# Altium schematic sheet Connectors.SchDoc
size Tabloid; SheetNumber: 2; SheetTotal: 11
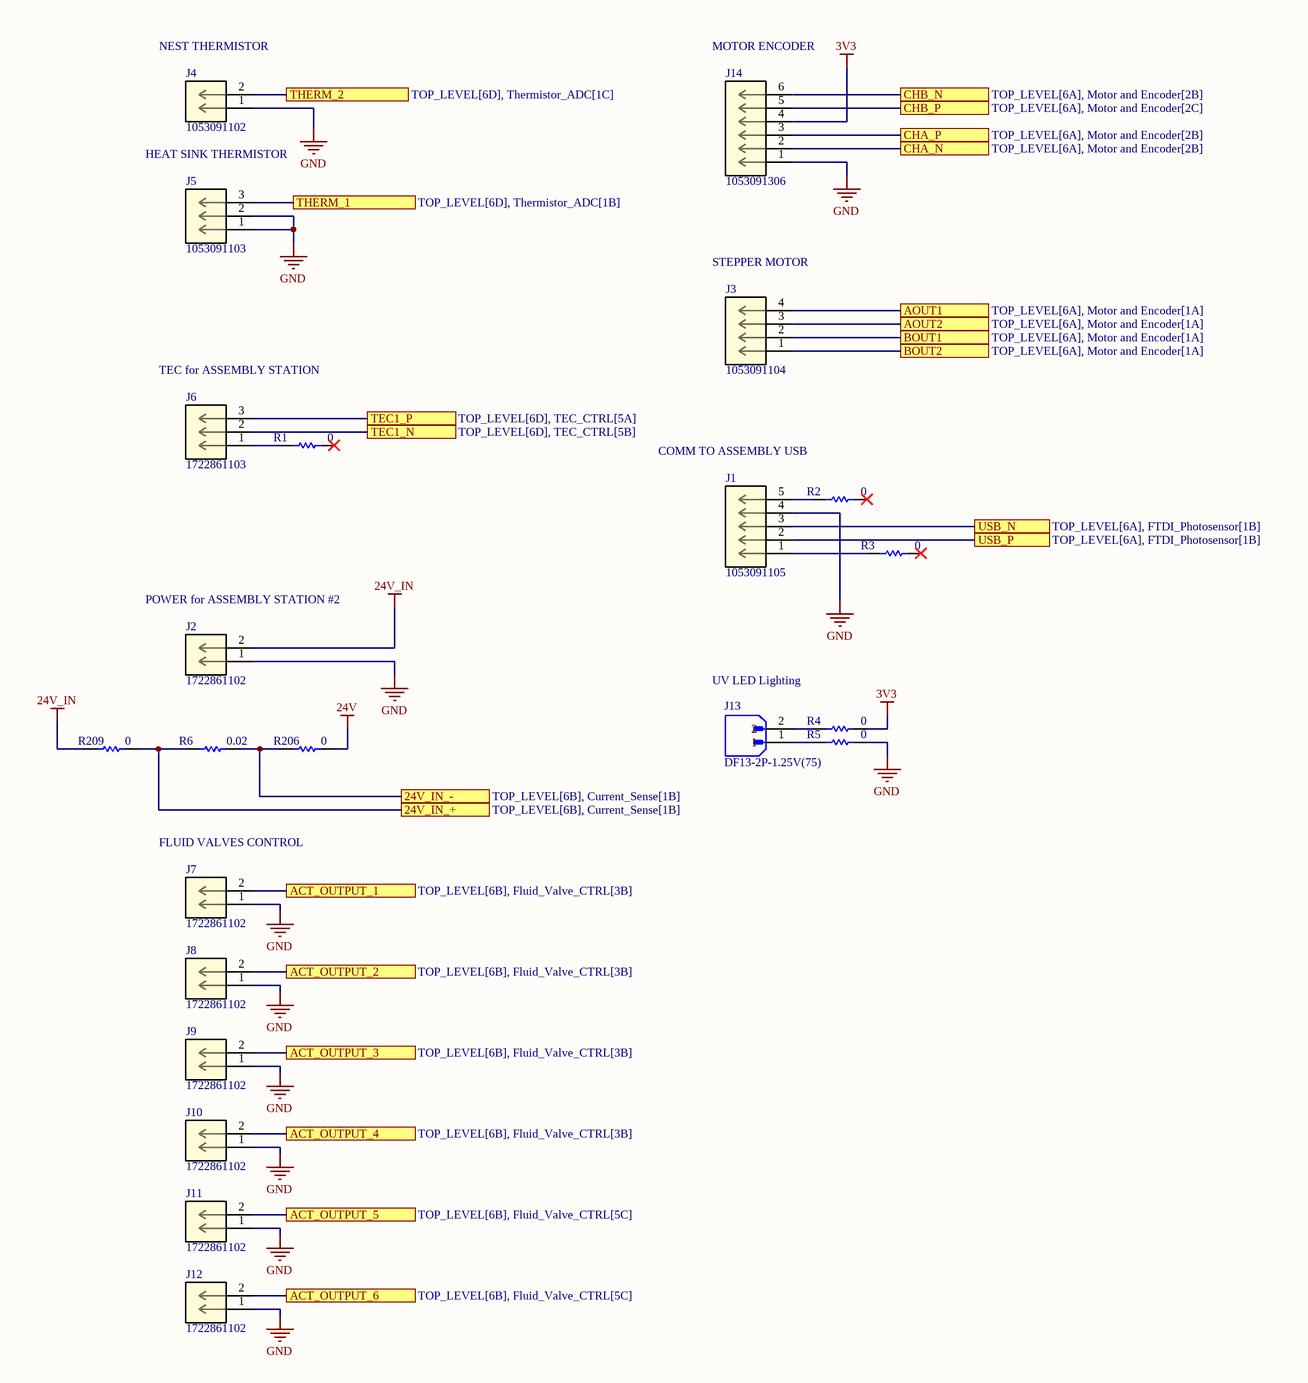
[diagram p0: Connectors.SchDoc]

## Parts
J1  1053091105  [1053091105]
J2  1722861102  [1722861102]
J3  1053091104  [1053091104]
J4  1053091102  [1053091102]
J5  1053091103  [1053091103]
J6  1722861103  [1722861103]
J7  1722861102  [1722861102]
J8  1722861102  [1722861102]
J9  1722861102  [1722861102]
J10  1722861102  [1722861102]
J11  1722861102  [1722861102]
J12  1722861102  [1722861102]
J13  DF13-2P-1.25V(75)  [DF13-2P-1.25V(75)]
J14  1053091306  [1053091306]
R1  value 0  [DEFAULT_RESISTOR_0805]  (hidden comment: RC0805JR-070RL)
R2  value 0  [DEFAULT_RESISTOR_0805]  (hidden comment: RC0805JR-070RL)
R3  value 0  [DEFAULT_RESISTOR_0805]  (hidden comment: RC0805JR-070RL)
R4  value 0  [DEFAULT_RESISTOR_0805]  (hidden comment: RC0805JR-070RL)
R5  value 0  [DEFAULT_RESISTOR_0805]  (hidden comment: RC0805JR-070RL)
R6  value 0.02  [DEFAULT_RESISTOR_0805]  (hidden comment: ERJ-6CWDR020V)
R206  value 0  [DEFAULT_RESISTOR_0805]  (hidden comment: RC0805JR-070RL)
R209  value 0  [DEFAULT_RESISTOR_0805]  (hidden comment: RC0805JR-070RL)

## Ports
24V_IN_+ (see TOP_LEVEL[6B], Current_Sense[1B]), 24V_IN_- (see TOP_LEVEL[6B], Current_Sense[1B]), ACT_OUTPUT_1 (see TOP_LEVEL[6B], Fluid_Valve_CTRL[3B]), ACT_OUTPUT_2 (see TOP_LEVEL[6B], Fluid_Valve_CTRL[3B]), ACT_OUTPUT_3 (see TOP_LEVEL[6B], Fluid_Valve_CTRL[3B]), ACT_OUTPUT_4 (see TOP_LEVEL[6B], Fluid_Valve_CTRL[3B]), ACT_OUTPUT_5 (see TOP_LEVEL[6B], Fluid_Valve_CTRL[5C]), ACT_OUTPUT_6 (see TOP_LEVEL[6B], Fluid_Valve_CTRL[5C]), AOUT1 (see TOP_LEVEL[6A], Motor and Encoder[1A]), AOUT2 (see TOP_LEVEL[6A], Motor and Encoder[1A]), BOUT1 (see TOP_LEVEL[6A], Motor and Encoder[1A]), BOUT2 (see TOP_LEVEL[6A], Motor and Encoder[1A]), CHA_N (see TOP_LEVEL[6A], Motor and Encoder[2B]), CHA_P (see TOP_LEVEL[6A], Motor and Encoder[2B]), CHB_N (see TOP_LEVEL[6A], Motor and Encoder[2B]), CHB_P (see TOP_LEVEL[6A], Motor and Encoder[2C]), TEC1_N (see TOP_LEVEL[6D], TEC_CTRL[5B]), TEC1_P (see TOP_LEVEL[6D], TEC_CTRL[5A]), THERM_1 (see TOP_LEVEL[6D], Thermistor_ADC[1B]), THERM_2 (see TOP_LEVEL[6D], Thermistor_ADC[1C]), USB_N (see TOP_LEVEL[6A], FTDI_Photosensor[1B]), USB_P (see TOP_LEVEL[6A], FTDI_Photosensor[1B])

## Nets
3V3: J14.4 R4.1
24V: R206.1
24V_IN: J2.2 R209.2
GND: J1.4 J2.1 J4.1 J5.1 J5.2 J7.1 J8.1 J9.1 J10.1 J11.1 J12.1 J14.1 R5.1
24V_IN_+: R6.2 R209.1 ; port 24V_IN_+
24V_IN_-: R6.1 R206.2 ; port 24V_IN_-
ACT_OUTPUT_1: J7.2 ; port ACT_OUTPUT_1
ACT_OUTPUT_2: J8.2 ; port ACT_OUTPUT_2
ACT_OUTPUT_3: J9.2 ; port ACT_OUTPUT_3
ACT_OUTPUT_4: J10.2 ; port ACT_OUTPUT_4
ACT_OUTPUT_5: J11.2 ; port ACT_OUTPUT_5
ACT_OUTPUT_6: J12.2 ; port ACT_OUTPUT_6
AOUT1: J3.4 ; port AOUT1
AOUT2: J3.3 ; port AOUT2
BOUT1: J3.2 ; port BOUT1
BOUT2: J3.1 ; port BOUT2
CHA_N: J14.2 ; port CHA_N
CHA_P: J14.3 ; port CHA_P
CHB_N: J14.6 ; port CHB_N
CHB_P: J14.5 ; port CHB_P
TEC1_N: J6.2 ; port TEC1_N
TEC1_P: J6.3 ; port TEC1_P
THERM_1: J5.3 ; port THERM_1
THERM_2: J4.2 ; port THERM_2
USB_N: J1.3 ; port USB_N
USB_P: J1.2 ; port USB_P
NetJ1_1: J1.1 R3.2
NetJ1_5: J1.5 R2.2
NetJ6_1: J6.1 R1.2
NetJ13_1: J13.1 R5.2
NetJ13_2: J13.2 R4.2

Not connected (* = marked no-connect by the designer): R1 1*; R2 1*; R3 1*

## Notes on the sheet
- (near J4) NEST THERMISTOR
- (near J14) MOTOR ENCODER
- HEAT SINK THERMISTOR
- (near J3) STEPPER MOTOR
- (near J6) TEC for ASSEMBLY STATION
- COMM TO ASSEMBLY USB
- (near J2) POWER for ASSEMBLY STATION #2
- UV LED Lighting
- (near J7) FLUID VALVES CONTROL

## Library data of the parts
J1 = 1053091105: Nano-Fit Vertical Header, Through Hole, 2.50mm Pitch, Single Row, 5 Circuits, with Kinked Pins, Tin (Sn) Plating, Black, Glow-Wire Capable, Tray; Manufacturer_Name: Molex Connector Corporation; Copyright: Copyright (C) 2025 Ultra Librarian. All rights reserved.; Manufacturer_Part_Number: 1053091105; RefDes: RefDes; Type: Type; MFR PN: 1053091105
J2 J7-J12 = 1722861102: Ultra-Fit Vertical Header, 3.50mm Pitch, Single Row, 2 Circuits, with Kinked Pins, Tin (Sn), Glow-Wire Capable, Black; Manufacturer_Name: Molex Connector Corporation; Copyright: Copyright (C) 2025 Ultra Librarian. All rights reserved.; Manufacturer_Part_Number: 1722861102; RefDes: RefDes; Type: Type; MFR PN: 1722861102
J3 = 1053091104: Nano-Fit Vertical Header, Through Hole, 2.50mm Pitch, Single Row, 4 Circuits, with Kinked Pins, Tin (Sn) Plating, Black, Glow-Wire Capable, Tray; Manufacturer_Name: Molex Connector Corporation; Copyright: Copyright (C) 2025 Ultra Librarian. All rights reserved.; Manufacturer_Part_Number: 1053091104; RefDes: RefDes; Type: Type; MFR PN: 1053091104
J4 = 1053091102: Nano-Fit Vertical Header, Through Hole, 2.50mm Pitch, Single Row, 2 Circuits, with Kinked Pins, Tin (Sn) Plating, Black, Glow-Wire Capable, Tray; Manufacturer_Name: Molex Connector Corporation; Copyright: Copyright (C) 2025 Ultra Librarian. All rights reserved.; Manufacturer_Part_Number: 1053091102; RefDes: RefDes; Type: Type; MFR PN: 1053091102
J5 = 1053091103: Nano-Fit Vertical Header, Through Hole, 2.50mm Pitch, Single Row, 3 Circuits, with Kinked Pins, Tin (Sn) Plating, Black, Glow-Wire Capable, Tray; Manufacturer_Name: Molex Connector Corporation; Copyright: Copyright (C) 2025 Ultra Librarian. All rights reserved.; Manufacturer_Part_Number: 1053091103; RefDes: RefDes; Type: Type; MFR PN: 1053091103
J6 = 1722861103: Ultra-Fit Vertical Header, 3.50mm Pitch, Single Row, 3 Circuits, with Kinked Pins, Tin (Sn), Glow-Wire Capable, Black; Manufacturer_Name: Molex Connector Corporation; Copyright: Copyright (C) 2025 Ultra Librarian. All rights reserved.; Manufacturer_Part_Number: 1722861103; RefDes: RefDes; Type: Type; MFR PN: 1722861103
J13 = DF13-2P-1.25V(75): Connector Header Surface Mount 2 position 0.049 (1.25mm); MF: Hirose Electric Co Ltd; SnapEDA_Link: https://www.snapeda.com/parts/DF13-2P-1.25V(75)/Hirose+Electric+Co+Ltd/view-part/?ref=snap; Package: None; Value: *; MP: DF13-2P-1.25V(75); Check_prices: https://www.snapeda.com/parts/DF13-2P-1.25V(75)/Hirose+Electric+Co+Ltd/view-part/?ref=eda; MFR PN: DF13-2P-1.25V(75)
J14 = 1053091306: Nano-Fit Vertical Header, Through Hole, 2.50mm Pitch, Single Row, 6 Circuits, with Kinked Pins, 0.76Âµm Gold (Au) Plating, Black, Glow-Wire Capable, Tray; Manufacturer_Name: Molex Connector Corporation; Copyright: Copyright (C) 2025 Ultra Librarian. All rights reserved.; Manufacturer_Part_Number: 1053091306; RefDes: RefDes; Type: Type; MFR PN: 1053091306
R1-R5 R206 R209 = RC0805JR-070RL: RES 0 OHM JUMPER 1/8W 0805; Power: 1/8W; MFR PN: RC0805JR-070RL; Tolerance: *
R6 = ERJ-6CWDR020V: RES 0.02 OHM 0.5% 1/2W 0805; Power: 1/2W; MFR PN: ERJ-6CWDR020V; Tolerance: 0.5%; Parameter 1: *